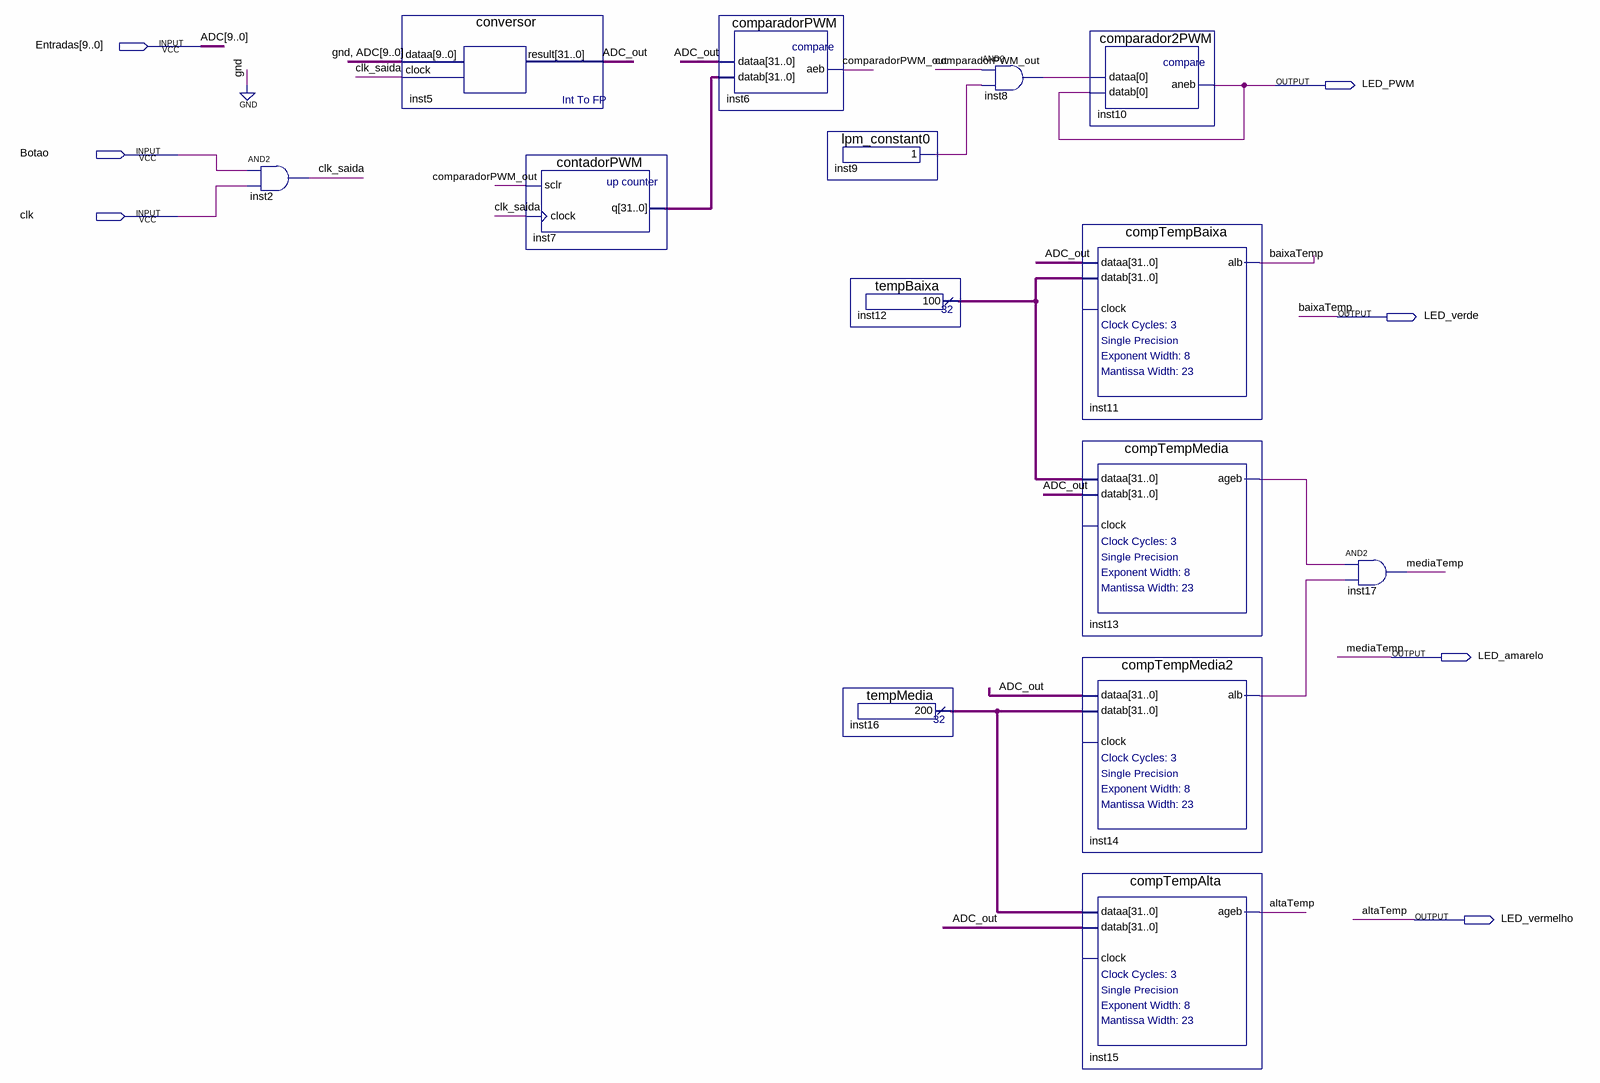
[diagram p0: schematic sheet]
// Quartus schematic controle_incendio.bdf as structural Verilog: 14 symbols, 7 pins
module controle_incendio (
  input  [9:0] Entradas,
  input  Botao,
  input  clk,
  output LED_PWM,
  output LED_verde,
  output LED_amarelo,
  output LED_vermelho
);

  wire ADC_out, clk_saida, comparadorPWM_out, inst8_out, inst9_result, inst13_ageb, inst14_alb;
  wire [31:0] inst7_q, inst12_result, inst16_result;

  and inst2 (clk_saida, Botao, clk);
  conversor inst5 (.dataa({1'b0, Entradas}), .clock(clk_saida), .result(ADC_out));
  contadorPWM inst7 (.sclr(comparadorPWM_out), .clock(clk_saida), .q(inst7_q));
  comparadorPWM inst6 (.dataa({32{ADC_out}}), .datab(inst7_q), .aeb(comparadorPWM_out));
  lpm_constant0 inst9 (.result(inst9_result));
  tempBaixa inst12 (.result(inst12_result));
  tempMedia inst16 (.result(inst16_result));
  and inst8 (inst8_out, comparadorPWM_out, inst9_result);
  comparador2PWM inst10 (.dataa(inst8_out), .datab(LED_PWM), .aneb(LED_PWM));
  compTempBaixa inst11 (.dataa({32{ADC_out}}), .datab(inst12_result), .alb(LED_verde));  // open: clock
  compTempMedia inst13 (.dataa(inst12_result), .datab({32{ADC_out}}), .ageb(inst13_ageb));  // open: clock
  compTempMedia2 inst14 (.dataa({32{ADC_out}}), .datab(inst16_result), .alb(inst14_alb));  // open: clock
  compTempAlta inst15 (.dataa(inst16_result), .datab({32{ADC_out}}), .ageb(LED_vermelho));  // open: clock
  and inst17 (LED_amarelo, inst13_ageb, inst14_alb);

  // Other names for the same wires on the sheet: ADC[9:0] = Entradas; altaTemp = LED_vermelho; baixaTemp = LED_verde;
  //   mediaTemp = LED_amarelo
endmodule
